# Altium schematic sheet CX4_enable_logic.SchDoc: FPGA Mezzanine Cards
size A3; Date: DO NOT USE, RATHER USE PROJ OPTIONS; DrawnBy: DO NOT USE, RATHER USE PROJ OPTIONS; Engineer: DO NOT USE, RATHER USE PROJ OPTIONS; Organization: DO NOT USE, RATHER USE PROJ OPTIONS; DocumentNumber: DO NOT USE, RATHER USE PROJ OPTIONS; Revision: DO NOT USE, RATHER USE PROJ OPTIONS; SheetNumber: 1; SheetTotal: 1; SCH_Sheet_Filename: <Filename.SchDoc>; CurrentTime: DO NOT USE, RATHER USE PROJ OPTIONS; Time: DO NOT USE, RATHER USE PROJ OPTIONS; DocumentFullPathAndName: DO NOT USE, RATHER USE PROJ OPTIONS; DocumentName: DO NOT USE, RATHER USE PROJ OPTIONS; ModifiedDate: DO NOT USE, RATHER USE PROJ OPTIONS; ImagePath: DO NOT USE, RATHER USE PROJ OPTIONS
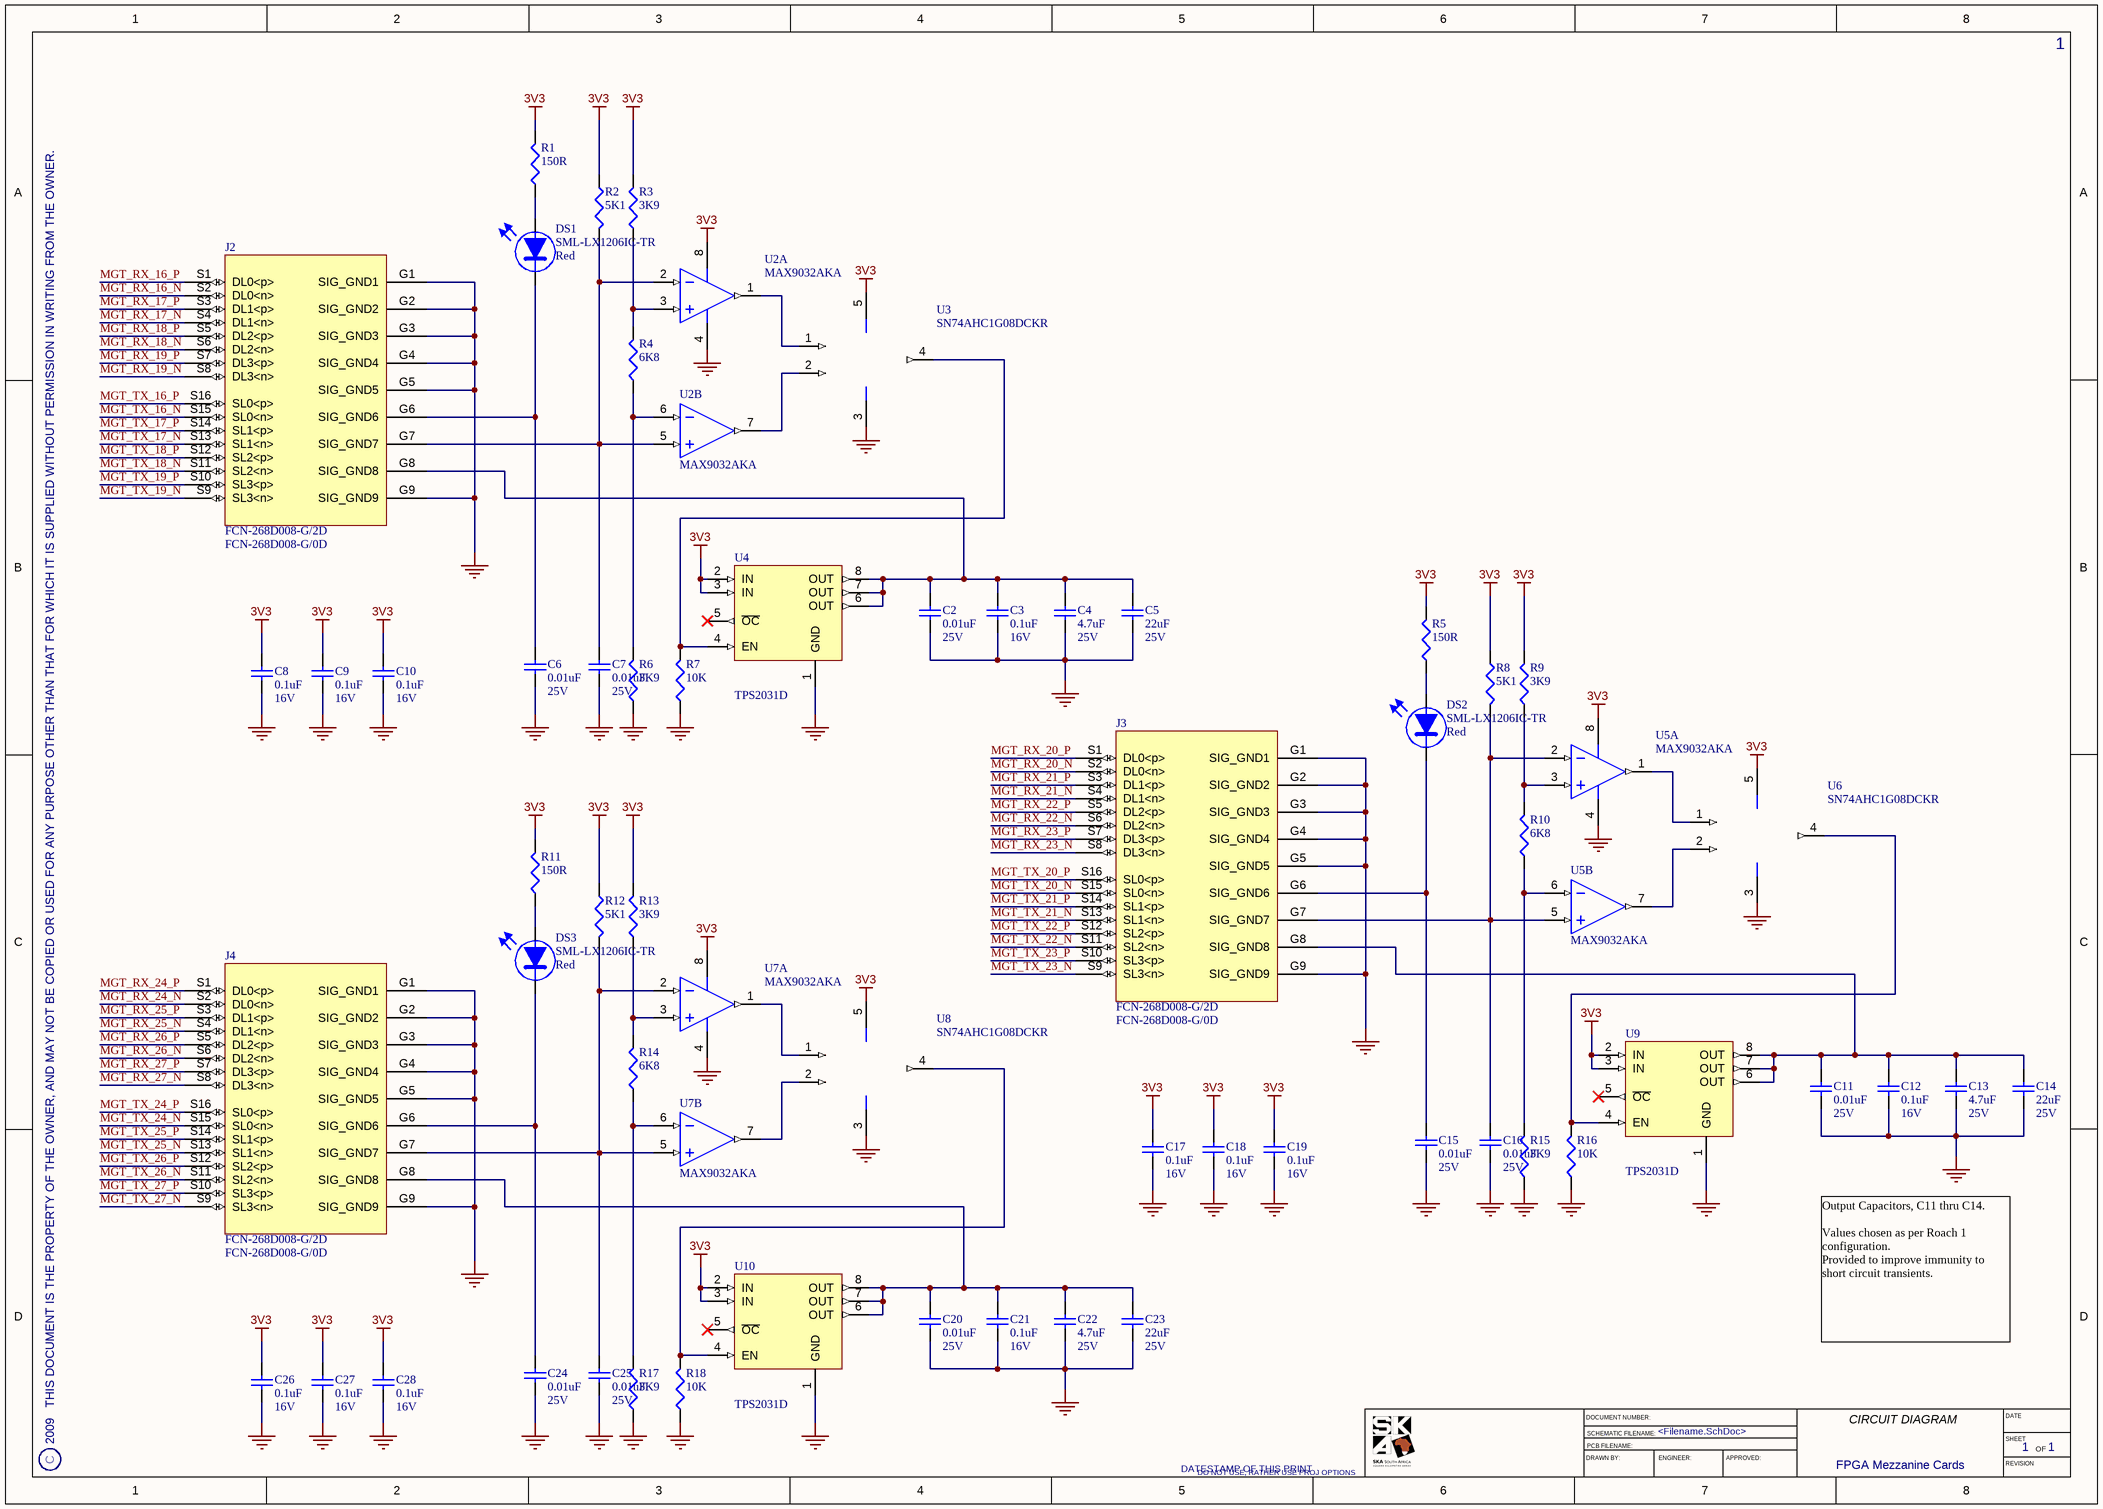
[diagram p0: CX4_enable_logic.SchDoc]

## Parts
C2  Rating: 25V  [CAPC1005X55L]  (hidden comment: 0.01uF)
C3  Rating: 16V  [CAPC1005X60L]  (hidden comment: 0.1uF)
C4  Rating: 25V  [CAPC2012X127L]  (hidden comment: 4.7uF)
C5  Rating: 25V  [CAPC3225X270L]  (hidden comment: 22uF)
C6  Rating: 25V  [CAPC1005X55L]  (hidden comment: 0.01uF)
C7  Rating: 25V  [CAPC1005X55L]  (hidden comment: 0.01uF)
C8  Rating: 16V  [CAPC1005X60L]  (hidden comment: 0.1uF)
C9  Rating: 16V  [CAPC1005X60L]  (hidden comment: 0.1uF)
C10  Rating: 16V  [CAPC1005X60L]  (hidden comment: 0.1uF)
C11  Rating: 25V  [CAPC1005X55L]  (hidden comment: 0.01uF)
C12  Rating: 16V  [CAPC1005X60L]  (hidden comment: 0.1uF)
C13  Rating: 25V  [CAPC2012X127L]  (hidden comment: 4.7uF)
C14  Rating: 25V  [CAPC3225X270L]  (hidden comment: 22uF)
C15  Rating: 25V  [CAPC1005X55L]  (hidden comment: 0.01uF)
C16  Rating: 25V  [CAPC1005X55L]  (hidden comment: 0.01uF)
C17  Rating: 16V  [CAPC1005X60L]  (hidden comment: 0.1uF)
C18  Rating: 16V  [CAPC1005X60L]  (hidden comment: 0.1uF)
C19  Rating: 16V  [CAPC1005X60L]  (hidden comment: 0.1uF)
C20  Rating: 25V  [CAPC1005X55L]  (hidden comment: 0.01uF)
C21  Rating: 16V  [CAPC1005X60L]  (hidden comment: 0.1uF)
C22  Rating: 25V  [CAPC2012X127L]  (hidden comment: 4.7uF)
C23  Rating: 25V  [CAPC3225X270L]  (hidden comment: 22uF)
C24  Rating: 25V  [CAPC1005X55L]  (hidden comment: 0.01uF)
C25  Rating: 25V  [CAPC1005X55L]  (hidden comment: 0.01uF)
C26  Rating: 16V  [CAPC1005X60L]  (hidden comment: 0.1uF)
C27  Rating: 16V  [CAPC1005X60L]  (hidden comment: 0.1uF)
C28  Rating: 16V  [CAPC1005X60L]  (hidden comment: 0.1uF)
DS1  SML-LX1206IC-TR  Colour: Red  [LEDC3216X120N]
DS2  SML-LX1206IC-TR  Colour: Red  [LEDC3216X120N]
DS3  SML-LX1206IC-TR  Colour: Red  [LEDC3216X120N]
J2  FCN-268D008-G/2D  PartNum: FCN-268D008-G/0D  [FCN-268D008-G]
J3  FCN-268D008-G/2D  PartNum: FCN-268D008-G/0D  [FCN-268D008-G]
J4  FCN-268D008-G/2D  PartNum: FCN-268D008-G/0D  [FCN-268D008-G]
R1  150R  [RESC1005X40L]
R2  5K1  [RESC1005X40L]
R3  3K9  [RESC1005X40L]
R4  6K8  [RESC1005X40L]
R5  150R  [RESC1005X40L]
R6  3K9  [RESC1005X40L]
R7  10K  [RESC1005X40L]
R8  5K1  [RESC1005X40L]
R9  3K9  [RESC1005X40L]
R10  6K8  [RESC1005X40L]
R11  150R  [RESC1005X40L]
R12  5K1  [RESC1005X40L]
R13  3K9  [RESC1005X40L]
R14  6K8  [RESC1005X40L]
R15  3K9  [RESC1005X40L]
R16  10K  [RESC1005X40L]
R17  3K9  [RESC1005X40L]
R18  10K  [RESC1005X40L]
U2  MAX9032AKA  [TSOT-23-8]  (parts A,B of 2)
U3  SN74AHC1G08DCKR  [SC70-5]
U4  TPS2031D  [SOIC150-8_N]
U5  MAX9032AKA  [TSOT-23-8]  (parts A,B of 2)
U6  SN74AHC1G08DCKR  [SC70-5]
U7  MAX9032AKA  [TSOT-23-8]  (parts A,B of 2)
U8  SN74AHC1G08DCKR  [SC70-5]
U9  TPS2031D  [SOIC150-8_N]
U10  TPS2031D  [SOIC150-8_N]

## Nets
3V3: C8.2 C9.2 C10.2 C17.2 C18.2 C19.2 C26.2 C27.2 C28.2 R1.2 R2.1 R3.2 R5.2 R8.1 R9.2 R11.2 R12.1 R13.2 U2.8(V+) U3.5(Vcc) U4.2(IN) U4.3(IN) U5.8(V+) U6.5(Vcc) U7.8(V+) U8.5(Vcc) U9.2(IN) U9.3(IN) U10.2(IN) U10.3(IN)
GND: C2.1 C3.1 C4.1 C5.1 C6.1 C7.1 C8.1 C9.1 C10.1 C11.1 C12.1 C13.1 C14.1 C15.1 C16.1 C17.1 C18.1 C19.1 C20.1 C21.1 C22.1 C23.1 C24.1 C25.1 C26.1 C27.1 C28.1 J2.G1(SIG_GND1) J2.G2(SIG_GND2) J2.G3(SIG_GND3) J2.G4(SIG_GND4) J2.G5(SIG_GND5) J2.G9(SIG_GND9) J3.G1(SIG_GND1) J3.G2(SIG_GND2) J3.G3(SIG_GND3) J3.G4(SIG_GND4) J3.G5(SIG_GND5) J3.G9(SIG_GND9) J4.G1(SIG_GND1) J4.G2(SIG_GND2) J4.G3(SIG_GND3) J4.G4(SIG_GND4) J4.G5(SIG_GND5) J4.G9(SIG_GND9) R6.1 R7.1 R15.1 R16.1 R17.1 R18.1 U2.4(V-) U3.3(GND) U4.1(GND) U5.4(V-) U6.3(GND) U7.4(V-) U8.3(GND) U9.1(GND) U10.1(GND)
MGT_RX_16_N: J2.S2(DL0<n>)
MGT_RX_16_P: J2.S1(DL0<p>)
MGT_RX_17_N: J2.S4(DL1<n>)
MGT_RX_17_P: J2.S3(DL1<p>)
MGT_RX_18_N: J2.S6(DL2<n>)
MGT_RX_18_P: J2.S5(DL2<p>)
MGT_RX_19_N: J2.S8(DL3<n>)
MGT_RX_19_P: J2.S7(DL3<p>)
MGT_RX_20_N: J3.S2(DL0<n>)
MGT_RX_20_P: J3.S1(DL0<p>)
MGT_RX_21_N: J3.S4(DL1<n>)
MGT_RX_21_P: J3.S3(DL1<p>)
MGT_RX_22_N: J3.S6(DL2<n>)
MGT_RX_22_P: J3.S5(DL2<p>)
MGT_RX_23_N: J3.S8(DL3<n>)
MGT_RX_23_P: J3.S7(DL3<p>)
MGT_RX_24_N: J4.S2(DL0<n>)
MGT_RX_24_P: J4.S1(DL0<p>)
MGT_RX_25_N: J4.S4(DL1<n>)
MGT_RX_25_P: J4.S3(DL1<p>)
MGT_RX_26_N: J4.S6(DL2<n>)
MGT_RX_26_P: J4.S5(DL2<p>)
MGT_RX_27_N: J4.S8(DL3<n>)
MGT_RX_27_P: J4.S7(DL3<p>)
MGT_TX_16_N: J2.S15(SL0<n>)
MGT_TX_16_P: J2.S16(SL0<p>)
MGT_TX_17_N: J2.S13(SL1<n>)
MGT_TX_17_P: J2.S14(SL1<p>)
MGT_TX_18_N: J2.S11(SL2<n>)
MGT_TX_18_P: J2.S12(SL2<p>)
MGT_TX_19_N: J2.S9(SL3<n>)
MGT_TX_19_P: J2.S10(SL3<p>)
MGT_TX_20_N: J3.S15(SL0<n>)
MGT_TX_20_P: J3.S16(SL0<p>)
MGT_TX_21_N: J3.S13(SL1<n>)
MGT_TX_21_P: J3.S14(SL1<p>)
MGT_TX_22_N: J3.S11(SL2<n>)
MGT_TX_22_P: J3.S12(SL2<p>)
MGT_TX_23_N: J3.S9(SL3<n>)
MGT_TX_23_P: J3.S10(SL3<p>)
MGT_TX_24_N: J4.S15(SL0<n>)
MGT_TX_24_P: J4.S16(SL0<p>)
MGT_TX_25_N: J4.S13(SL1<n>)
MGT_TX_25_P: J4.S14(SL1<p>)
MGT_TX_26_N: J4.S11(SL2<n>)
MGT_TX_26_P: J4.S12(SL2<p>)
MGT_TX_27_N: J4.S9(SL3<n>)
MGT_TX_27_P: J4.S10(SL3<p>)
NetC2_2: C2.2 C3.2 C4.2 C5.2 J2.G8(SIG_GND8) U4.6(OUT) U4.7(OUT) U4.8(OUT)
NetC6_2: C6.2 DS1.1(K) J2.G6(SIG_GND6)
NetC7_2: C7.2 J2.G7(SIG_GND7) R2.2 U2.2(INA-) U2.5(INB+)
NetC11_2: C11.2 C12.2 C13.2 C14.2 J3.G8(SIG_GND8) U9.6(OUT) U9.7(OUT) U9.8(OUT)
NetC15_2: C15.2 DS2.1(K) J3.G6(SIG_GND6)
NetC16_2: C16.2 J3.G7(SIG_GND7) R8.2 U5.2(INA-) U5.5(INB+)
NetC20_2: C20.2 C21.2 C22.2 C23.2 J4.G8(SIG_GND8) U10.6(OUT) U10.7(OUT) U10.8(OUT)
NetC24_2: C24.2 DS3.1(K) J4.G6(SIG_GND6)
NetC25_2: C25.2 J4.G7(SIG_GND7) R12.2 U7.2(INA-) U7.5(INB+)
NetDS1_2: DS1.2(A) R1.1
NetDS2_2: DS2.2(A) R5.1
NetDS3_2: DS3.2(A) R11.1
NetR3_1: R3.1 R4.2 U2.3(INA+)
NetR4_1: R4.1 R6.2 U2.6(INB-)
NetR7_2: R7.2 U3.4(OUT_(Y)) U4.4(EN)
NetR9_1: R9.1 R10.2 U5.3(INA+)
NetR10_1: R10.1 R15.2 U5.6(INB-)
NetR13_1: R13.1 R14.2 U7.3(INA+)
NetR14_1: R14.1 R17.2 U7.6(INB-)
NetR16_2: R16.2 U6.4(OUT_(Y)) U9.4(EN)
NetR18_2: R18.2 U8.4(OUT_(Y)) U10.4(EN)
NetU2_1: U2.1(OUTA) U3.1(IN_(A))
NetU2_7: U2.7(OUTB) U3.2(IN_(B))
NetU5_1: U5.1(OUTA) U6.1(IN_(A))
NetU5_7: U5.7(OUTB) U6.2(IN_(B))
NetU7_1: U7.1(OUTA) U8.1(IN_(A))
NetU7_7: U7.7(OUTB) U8.2(IN_(B))

Not connected (* = marked no-connect by the designer): U4 5(~{OC})*; U9 5(~{OC})*; U10 5(~{OC})*

## Notes on the sheet
- Output Capacitors, C11 thru C14.
  Values chosen as per Roach 1 configuration.
  Provided to improve immunity to short circuit transients.
- 2009   THIS DOCUMENT IS THE PROPERTY OF THE OWNER, AND MAY NOT BE COPIED OR USED FOR ANY PURPOSE OTHER THAN THAT FOR WHICH IT IS SUPPLIED WITHOUT PERMISSION IN WRITING FROM THE OWNER.
- C
- DATESTAMP OF THIS PRINT
- DRAWN BY:
- DOCUMENT NUMBER:
- SCHEMATIC FILENAME:
- PCB FILENAME:
- ENGINEER:
- APPROVED:
- CIRCUIT DIAGRAM
- DATE
- SHEET
- REVISION
- OF

## Library data of the parts
C2 C6 C7 C11 C15 C16 C20 C24 C25 = CAP-CER-6: 0.01uF, Ceramic Capacitor; Manufacturer: MURATA; PartNum: GRM155R71E103KA01D; Tolerance: 10%; Dielectric: X7R; POD number: CAP-CER-6; Value: 0.01uF; RoHS: Y; Sort Value: 0.01; Category: Capacitors; Subcategory: Ceramic
C3 C8-C10 C12 C17-C19 C21 C26-C28 = CAP-CER-1: 0.1uF, Ceramic Capacitor; Manufacturer: VENKEL; PartNum: C0402X7R160-104KN; Tolerance: 10%; Dielectric: X7R; POD number: CAP-CER-1; Value: 0.1uF; RoHS: Y; Sort Value: 0.1; Category: Capacitors; Subcategory: Ceramic
C4 C13 C22 = CAP-CER-3: 4.7uF, Ceramic Capacitor; Manufacturer: MURATA; PartNum: GRM21BR61E475KA12K; Tolerance: 10%; Dielectric: X5R; POD number: CAP-CER-3; Value: 4.7uF; RoHS: Y; Sort Value: 4.7; Category: Capacitors; Subcategory: Ceramic
C5 C14 C23 = CAP-CER-9: 22uF, Ceramic Capacitor; Manufacturer: MURATA; PartNum: GRM32ER61E226ME15L; Tolerance: 20%; Dielectric: X5R; POD number: CAP-CER-9; Value: 22uF; RoHS: Y; Sort Value: 22; Category: Capacitors; Subcategory: Ceramic
DS1-DS3 = OPTO-LED-1: Red, Surface mount, LED, 1206; Manufacturer: LUMEX; Vdrop: 2V; Rating: 20mA; POD number: OPTO-LED-1; PartNum: SML-LX1206IC-TR; RoHS: Y; Category: OPTO; Subcategory: LED
J2-J4 = CONN-PCB-25: CX4/Infiniband 4 channel Socket Connector; Manufacturer: Fujitsu; POD number: CONN-PCB-25; RoHS: Y; Category: CONN; Subcategory: PCB
R1 R5 R11 = RES-TF-48: 150R, 1.1mm x 0.5mm, Thick Film Resistor; Manufacturer: ROYALOHM; PartNum: 0402WGJ0151T1E; Tolerance: 5%; Rating: 0.0625W; POD number: RES-TF-48; Value: 150R; Sort Value: 150; Category: Resistors; Subcategory: ThickFilm; HelpURL: http://www.royalohm.com/pdf/general.pdf
R2 R8 R12 = RES-TF-46: 5K1, 1.1mm x 0.5mm, Thick Film Resistor; Manufacturer: ROYALOHM; PartNum: 0402WAJ0512T1E; Tolerance: 1%; Rating: 0.0625W; POD number: RES-TF-46; Value: 5K1; Sort Value: 5100; Category: Resistors; Subcategory: ThickFilm; HelpURL: http://www.royalohm.com/pdf/general.pdf
R3 R6 R9 R13 R15 R17 = RES-TF-45: 3K9, 1.1mm x 0.5mm, Thick Film Resistor; Manufacturer: ROYALOHM; PartNum: 0402WGJ0392T1E; Tolerance: 5%; Rating: 0.0625W; POD number: RES-TF-45; Value: 3K9; Sort Value: 3900; Category: Resistors; Subcategory: ThickFilm; HelpURL: http://www.royalohm.com/pdf/general.pdf
R4 R10 R14 = RES-TF-47: 6K8, 1.1mm x 0.5mm, Thick Film Resistor; Manufacturer: ROYALOHM; PartNum: 0402WGJ0682T1E; Tolerance: 5%; Rating: 0.0625W; POD number: RES-TF-47; Value: 6K8; Sort Value: 6800; Category: Resistors; Subcategory: ThickFilm; HelpURL: http://www.royalohm.com/pdf/general.pdf
R7 R16 R18 = RES-TF-5: 10K, 1.1mm x 0.5mm, Thick Film Resistor; Manufacturer: ROYALOHM; PartNum: 0402WGJ0103T1E; Tolerance: 5%; Rating: 0.0625W; POD number: RES-TF-5; Value: 10K; Sort Value: 10000; Category: Resistors; Subcategory: ThickFilm; HelpURL: http://www.royalohm.com/pdf/general.pdf
U2 U5 U7 = IC-COMP-0: Dual Single-Supply Comparator; Manufacturer: MAXIM; POD number: IC-COMP-0; PartNum: MAX9032AKA; Category: IC; Subcategory: Comparator
U3 U6 U8 = IC-LOG-17: Single 2-Input Positive-AND Gate; Manufacturer: Texas Instruments; POD number: IC-LOG-17; PartNum: SN74AHC1G08DCKR; RoHS: Y; Category: IC; Subcategory: Logic
U4 U9 U10 = IC-DISC-0: Power-Distribution Switch; Manufacturer: Texas Instruments; POD number: IC-DISC-0; PartNum: TPS2031D; RoHS: Y; Category: IC; Subcategory: Switch